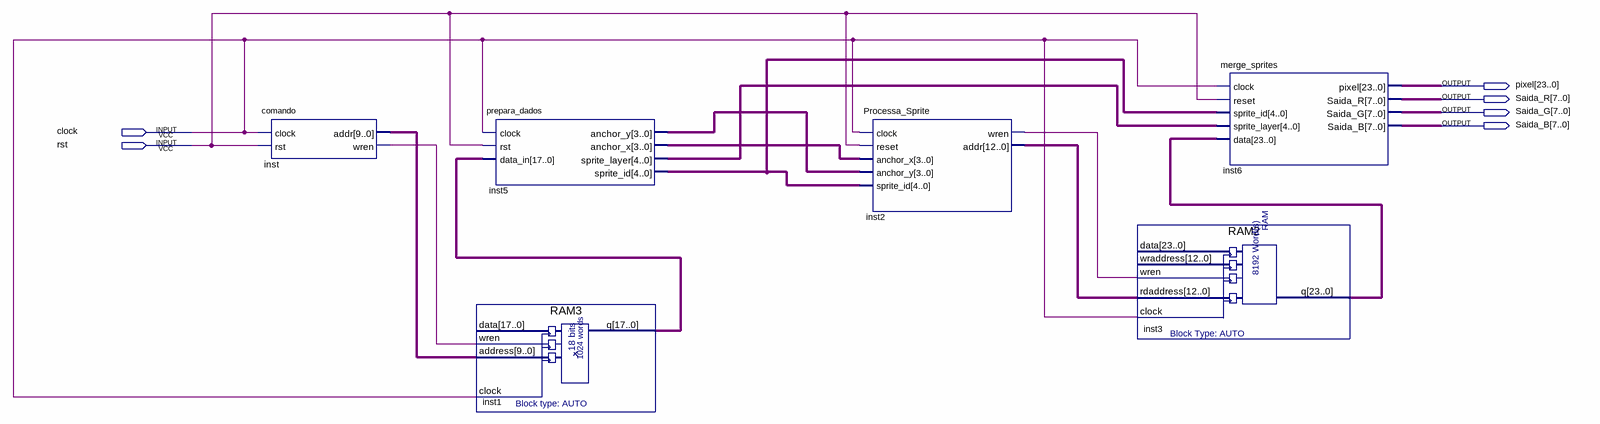
[diagram p0: schematic sheet]
// Quartus schematic SpriteMemoria.bdf as structural Verilog: 6 symbols, 6 pins
module SpriteMemoria (
  input  clock,
  input  rst,
  output [23:0] pixel,
  output [7:0] Saida_R,
  output [7:0] Saida_G,
  output [7:0] Saida_B
);

  wire inst2_wren, inst_wren;
  wire [3:0] inst5_anchor_x, inst5_anchor_y;
  wire [4:0] inst5_sprite_id, inst5_sprite_layer;
  wire [9:0] inst_addr;
  wire [12:0] inst2_addr;
  wire [17:0] inst1_q;
  wire [23:0] inst3_q;

  comando inst (.clock(clock), .rst(rst), .addr(inst_addr), .wren(inst_wren));
  prepara_dados inst5 (
    .clock(clock), .rst(rst), .data_in(inst1_q), .anchor_y(inst5_anchor_y), .anchor_x(inst5_anchor_x),
    .sprite_layer(inst5_sprite_layer), .sprite_id(inst5_sprite_id));
  RAM3 inst1 (.wren(inst_wren), .address(inst_addr), .clock(clock), .q(inst1_q));  // open: data
  Processa_Sprite inst2 (
    .clock(clock), .reset(rst), .anchor_x(inst5_anchor_x), .anchor_y(inst5_anchor_y),
    .sprite_id(inst5_sprite_id), .wren(inst2_wren), .addr(inst2_addr));
  RAM2 inst3 (.wren(inst2_wren), .rdaddress(inst2_addr), .clock(clock), .q(inst3_q));  // open: data, wraddress
  merge_sprites inst6 (
    .clock(clock), .reset(rst), .sprite_id(inst5_sprite_id), .sprite_layer(inst5_sprite_layer),
    .data(inst3_q), .pixel(pixel), .Saida_R(Saida_R), .Saida_G(Saida_G), .Saida_B(Saida_B));
endmodule
